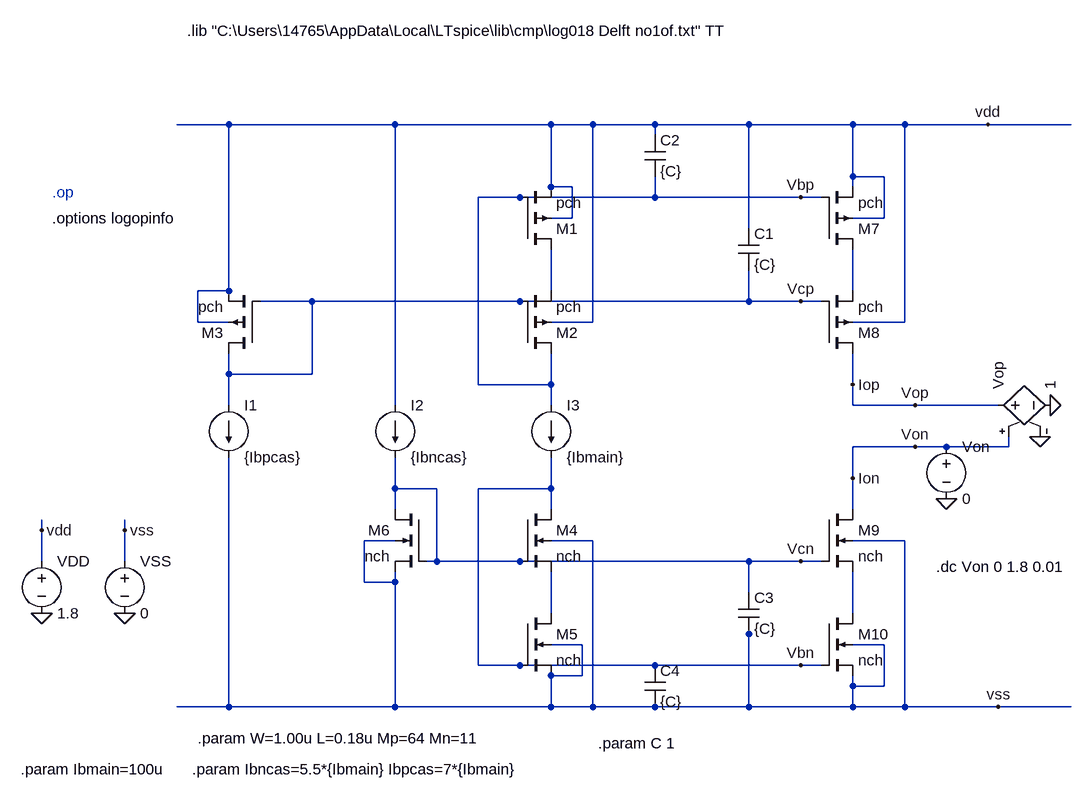
[diagram p0: schematic Draft4.asc]
Draft4.asc, the LTspice schematic file:
Version 4.1
SHEET 1 1828 848
WIRE 64 -272 -16 -272
WIRE 320 -272 64 -272
WIRE 560 -272 320 -272
WIRE 624 -272 560 -272
WIRE 720 -272 624 -272
WIRE 864 -272 720 -272
WIRE 1024 -272 864 -272
WIRE 1104 -272 1024 -272
WIRE 1232 -272 1104 -272
WIRE 1360 -272 1232 -272
WIRE 720 -256 720 -272
WIRE 1024 -192 1024 -272
WIRE 1072 -192 1024 -192
WIRE 560 -176 560 -272
WIRE 592 -176 560 -176
WIRE 1024 -176 1024 -192
WIRE 512 -160 448 -160
WIRE 720 -160 720 -192
WIRE 720 -160 512 -160
WIRE 944 -160 720 -160
WIRE 976 -160 944 -160
WIRE 592 -128 592 -176
WIRE 592 -128 560 -128
WIRE 1072 -128 1072 -192
WIRE 1072 -128 1024 -128
WIRE 864 -112 864 -272
WIRE 64 -16 64 -272
WIRE 64 -16 16 -16
WIRE 560 -16 560 -80
WIRE 1024 -16 1024 -80
WIRE 192 0 112 0
WIRE 512 0 192 0
WIRE 864 0 864 -48
WIRE 864 0 512 0
WIRE 944 0 864 0
WIRE 976 0 944 0
WIRE 16 32 16 -16
WIRE 64 32 16 32
WIRE 624 32 624 -272
WIRE 624 32 560 32
WIRE 1104 32 1104 -272
WIRE 1104 32 1024 32
WIRE 64 112 64 80
WIRE 192 112 192 0
WIRE 192 112 64 112
WIRE 448 128 448 -160
WIRE 560 128 560 80
WIRE 560 128 448 128
WIRE 1024 128 1024 80
WIRE 64 160 64 112
WIRE 320 160 320 -272
WIRE 560 160 560 128
WIRE 1024 160 1024 128
WIRE 1120 160 1024 160
WIRE 1248 160 1120 160
WIRE 1120 224 1024 224
WIRE 1168 224 1120 224
WIRE 1264 224 1264 208
WIRE 1264 224 1168 224
WIRE 1024 272 1024 224
WIRE 320 288 320 240
WIRE 384 288 320 288
WIRE 560 288 560 240
WIRE 560 288 448 288
WIRE 320 320 320 288
WIRE 560 320 560 288
WIRE 1024 320 1024 272
WIRE -224 352 -224 336
WIRE -96 352 -96 336
WIRE 320 368 272 368
WIRE 624 368 560 368
WIRE 1104 368 1024 368
WIRE -224 400 -224 352
WIRE -96 400 -96 352
WIRE 384 400 384 288
WIRE 384 400 368 400
WIRE 512 400 384 400
WIRE 864 400 512 400
WIRE 944 400 864 400
WIRE 976 400 944 400
WIRE 272 432 272 368
WIRE 320 432 320 416
WIRE 320 432 272 432
WIRE 864 448 864 400
WIRE 560 480 560 416
WIRE 1024 480 1024 416
WIRE 864 512 864 496
WIRE 608 528 560 528
WIRE 1072 528 1024 528
WIRE 448 560 448 288
WIRE 512 560 448 560
WIRE 720 560 512 560
WIRE 944 560 720 560
WIRE 976 560 944 560
WIRE 608 576 608 528
WIRE 608 576 560 576
WIRE 1024 592 1024 576
WIRE 1072 592 1072 528
WIRE 1072 592 1024 592
WIRE 64 624 64 240
WIRE 64 624 -16 624
WIRE 320 624 320 432
WIRE 320 624 64 624
WIRE 560 624 560 576
WIRE 560 624 320 624
WIRE 624 624 624 368
WIRE 624 624 560 624
WIRE 720 624 624 624
WIRE 864 624 864 512
WIRE 864 624 720 624
WIRE 1024 624 1024 592
WIRE 1024 624 864 624
WIRE 1104 624 1104 368
WIRE 1104 624 1024 624
WIRE 1248 624 1104 624
WIRE 1360 624 1248 624
FLAG -224 480 0
FLAG -96 480 0
FLAG -96 352 vss
FLAG -224 352 vdd
FLAG 1232 -272 vdd
FLAG 1248 624 vss
FLAG 1120 160 Vop
FLAG 1120 224 Von
FLAG 944 -160 Vbp
FLAG 944 0 Vcp
FLAG 944 400 Vcn
FLAG 944 560 Vbn
FLAG 1024 128 Iop
FLAG 1024 272 Ion
FLAG 1168 304 0
FLAG 1312 208 0
FLAG 1328 160 0
SYMBOL voltage -224 384 R0
WINDOW 123 0 0 Left 0
WINDOW 39 0 0 Left 0
SYMATTR InstName VDD
SYMATTR Value 1.8
SYMBOL voltage -96 384 R0
WINDOW 123 0 0 Left 0
WINDOW 39 0 0 Left 0
SYMATTR InstName VSS
SYMATTR Value 0
SYMBOL pmos4 512 -80 M180
SYMATTR InstName M1
SYMATTR Value pch
SYMATTR Value2 l={L} w={W} m={Mp}
SYMBOL pmos4 512 80 M180
SYMATTR InstName M2
SYMATTR Value pch
SYMATTR Value2 l={L} w={W} m={Mp}
SYMBOL nmos4 512 320 R0
SYMATTR InstName M4
SYMATTR Value nch
SYMATTR Value2 l={L} w={W} m={Mn}
SYMBOL nmos4 512 480 R0
SYMATTR InstName M5
SYMATTR Value nch
SYMATTR Value2 l={L} w={W} m={Mn}
SYMBOL current 64 160 R0
WINDOW 123 0 0 Left 0
WINDOW 39 0 0 Left 0
SYMATTR InstName I1
SYMATTR Value {Ibpcas}
SYMBOL current 320 160 R0
WINDOW 123 0 0 Left 0
WINDOW 39 0 0 Left 0
SYMATTR InstName I2
SYMATTR Value {Ibncas}
SYMBOL current 560 160 R0
WINDOW 123 0 0 Left 0
WINDOW 39 0 0 Left 0
SYMATTR InstName I3
SYMATTR Value {Ibmain}
SYMBOL pmos4 112 80 R180
SYMATTR InstName M3
SYMATTR Value pch
SYMATTR Value2 l={L} w={W} m={Mp}
SYMBOL nmos4 368 320 M0
SYMATTR InstName M6
SYMATTR Value nch
SYMATTR Value2 l={L} w={W} m={Mn}
SYMBOL pmos4 976 -80 M180
SYMATTR InstName M7
SYMATTR Value pch
SYMATTR Value2 l={L} w={W} m={Mp}
SYMBOL pmos4 976 80 M180
SYMATTR InstName M8
SYMATTR Value pch
SYMATTR Value2 l={L} w={W} m={Mp}
SYMBOL nmos4 976 320 R0
SYMATTR InstName M9
SYMATTR Value nch
SYMATTR Value2 l={L} w={W} m={Mn}
SYMBOL nmos4 976 480 R0
SYMATTR InstName M10
SYMATTR Value nch
SYMATTR Value2 l={L} w={W} m={Mn}
SYMBOL cap 848 -112 R0
SYMATTR InstName C1
SYMATTR Value {C}
SYMBOL cap 704 -256 R0
SYMATTR InstName C2
SYMATTR Value {C}
SYMBOL cap 848 448 R0
SYMATTR InstName C3
SYMATTR Value {C}
SYMBOL cap 704 560 R0
SYMATTR InstName C4
SYMATTR Value {C}
SYMBOL voltage 1168 208 R0
WINDOW 123 0 0 Left 0
WINDOW 39 0 0 Left 0
SYMATTR InstName Von
SYMATTR Value 0
SYMBOL e 1232 160 R270
SYMATTR InstName Vop
SYMATTR Value 1
TEXT 16 672 Left 2 !.param W=1.00u L=0.18u Mp=64 Mn=11
TEXT -256 720 Left 2 !.param Ibmain=100u
TEXT 8 720 Left 2 !.param Ibncas=5.5*{Ibmain} Ibpcas=7*{Ibmain}
TEXT -208 -168 Left 2 ;.op
TEXT -208 -128 Left 2 !.options logopinfo
TEXT 632 680 Left 2 !.param C 1
TEXT 0 -416 Left 2 !.lib "C:\\Users\\14765\\AppData\\Local\\LTspice\\lib\\cmp\\log018 Delft no1of.txt" TT
TEXT 1152 408 Left 2 !.dc Von 0 1.8 0.01

The netlist it stands for:
* Draft4.asc
VDD vdd 0 1.8
VSS vss 0 0
M1 N001 Vbp vdd vdd pch l={L} w={W} m={Mp}
M2 Vbp Vcp N001 vdd pch l={L} w={W} m={Mp}
M4 Vbn Vcn N003 vss nch l={L} w={W} m={Mn}
M5 N003 Vbn vss vss nch l={L} w={W} m={Mn}
I1 Vcp vss {Ibpcas}
I2 vdd Vcn {Ibncas}
I3 Vbp Vbn {Ibmain}
M3 Vcp Vcp vdd vdd pch l={L} w={W} m={Mp}
M6 Vcn Vcn vss vss nch l={L} w={W} m={Mn}
M7 N002 Vbp vdd vdd pch l={L} w={W} m={Mp}
M8 Iop Vcp N002 vdd pch l={L} w={W} m={Mp}
M9 Ion Vcn N004 vss nch l={L} w={W} m={Mn}
M10 N004 Vbn vss vss nch l={L} w={W} m={Mn}
C1 vdd Vcp {C}
C2 vdd Vbp {C}
C3 Vcn vss {C}
C4 Vbn vss {C}
Von Ion 0 0
E§Vop Iop 0 Ion 0 1
.model NMOS NMOS
.model PMOS PMOS
.lib standard.mos
.param W=1.00u L=0.18u Mp=64 Mn=11
.param Ibmain=100u
.param Ibncas=5.5*{Ibmain} Ibpcas=7*{Ibmain}
* .op
.options logopinfo
.param C 1
.lib "C:\Users\14765\AppData\Local\LTspice\lib\cmp\log018 Delft no1of.txt" TT
.dc Von 0 1.8 0.01
.backanno
.end